# Altium schematic sheet Mynd_Conn.SchDoc: =SCH_Title
size A3; DocumentNumber: 1; SheetNumber: 1; SheetTotal: 1
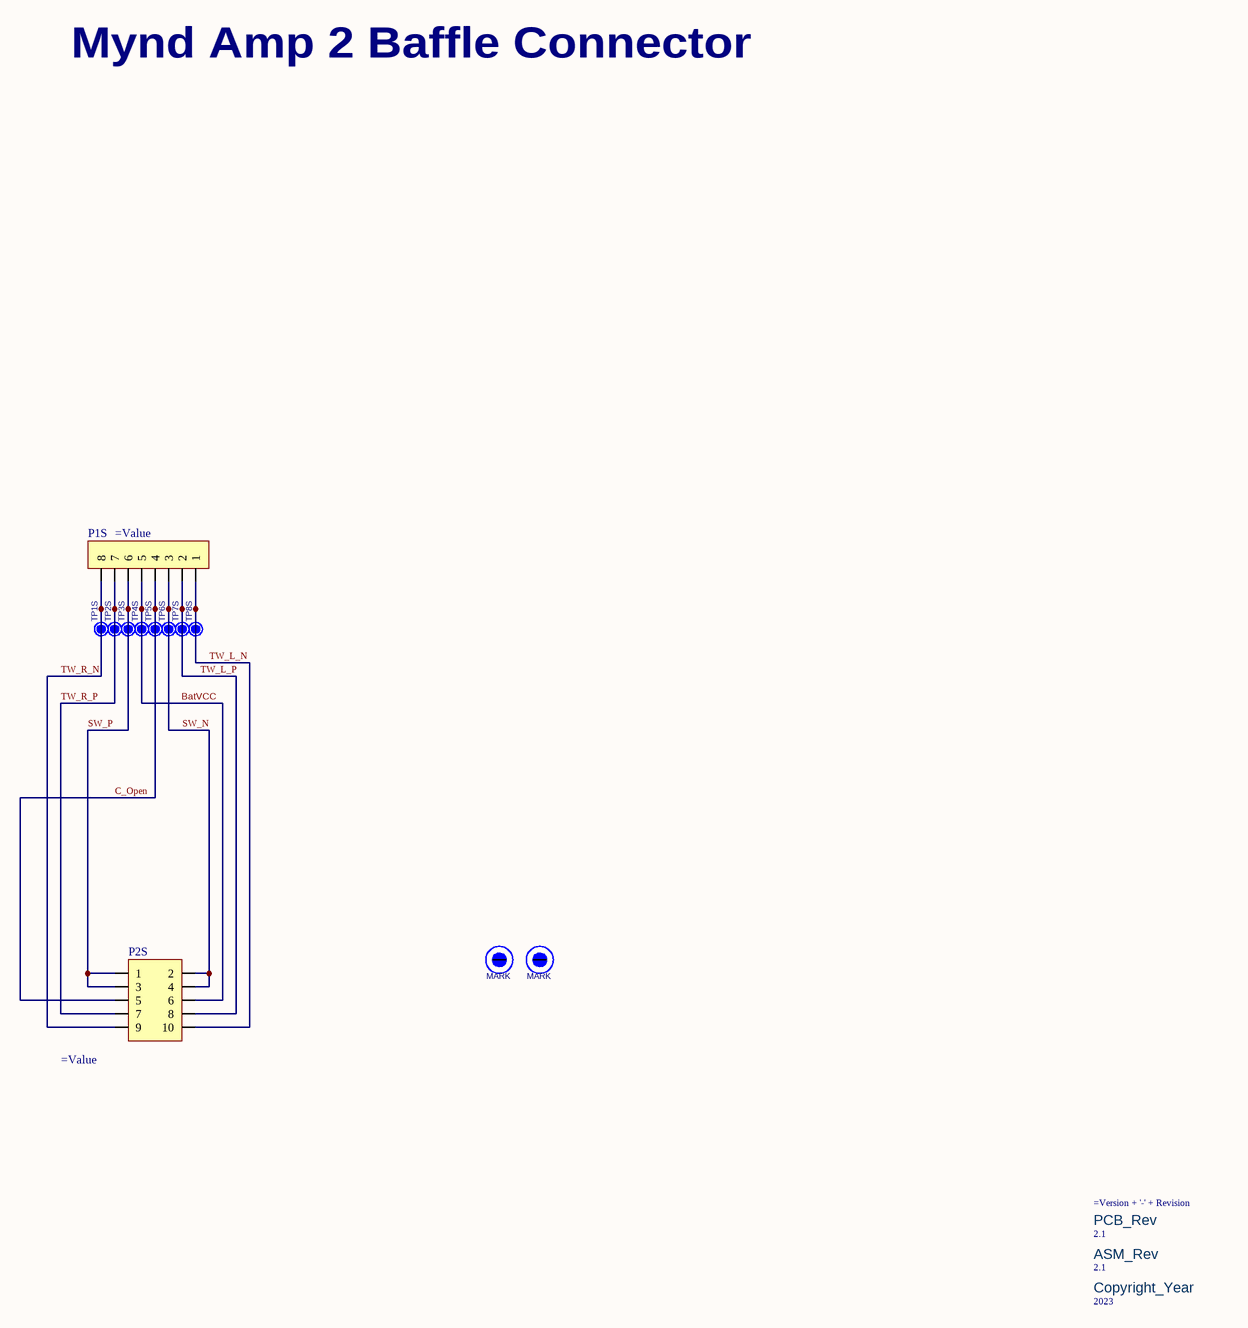
[diagram p0: Mynd_Conn.SchDoc]

## Parts
MK1S  MARK  [MARK]  (no BOM)
MK2S  MARK  [MARK]  (no BOM)
P1S  (no value)  [CJL008DH250197]
P2S  (no value)  [Pin_Header_SMD_Side_2X5_254]
Teufel_ASM_Label1S  2.1  [Teufel_ASM_Rev]  (no BOM)
Teufel_Copyright1S  2023  [Teufel_Copyright]  (no BOM)
Teufel_PCB_Label1S  2.1  [Teufel_PCB_Rev]  (no BOM)
Teufel_PCB_Logo?  (no value)  [Teufel_NoLogo]  (no BOM)
TP1S  TP12  [TP120]  (value not drawn)  (no BOM)
TP2S  TP12  [TP120]  (value not drawn)  (no BOM)
TP3S  TP12  [TP120]  (value not drawn)  (no BOM)
TP4S  TP12  [TP120]  (value not drawn)  (no BOM)
TP5S  TP12  [TP120]  (value not drawn)  (no BOM)
TP6S  TP12  [TP120]  (value not drawn)  (no BOM)
TP7S  TP12  [TP120]  (value not drawn)  (no BOM)
TP8S  TP12  [TP120]  (value not drawn)  (no BOM)

## Nets
BatVCC: P1S.5 P2S.6 TP4S.1
C_Open: P1S.4 P2S.5 TP5S.1
SW_N: P1S.3 P2S.2 P2S.4 TP6S.1
SW_P: P1S.6 P2S.1 P2S.3 TP3S.1
TW_L_N: P1S.1 P2S.10 TP8S.1
TW_L_P: P1S.2 P2S.8 TP7S.1
TW_R_N: P1S.8 P2S.9 TP1S.1
TW_R_P: P1S.7 P2S.7 TP2S.1

Not connected (* = marked no-connect by the designer): MK1S MK_B MK_T; MK2S MK_B MK_T

## Notes on the sheet
- Mynd Amp 2 Baffle Connector
- Revision:
- Lautspreecher Teufel GmbH
- Budapester Straße 44
- 10787 Berlin
- Germany
- Page Title:
- Engineer:
- Project:
- Version:
- Rev:
- modified:
- Date:
- Size:
- A3
- File Name:
- Page:
- of
- (in symbol Teufel_ASM_Rev) ASM_Rev
- (in symbol Teufel_Copyright) Copyright_Year
- (in symbol Teufel_PCB_Rev) PCB_Rev

## Library data of the parts
MK1S MK2S = N-001-00003-2: MARK DOT; Design Item ID: MARK
P1S = C-001-1104-3: SMD BTB CONNECTOR 8P P2.5mm GOLD; Manufacturer: CHUANGJIEL; Part_Type: Connector BTB SMT; Value: CJL008DH250197; System: Connector; Part_Number: CJL008DH250197
P2S = C-001-1092-3: SMD BTB CONNECTOR 10P P2.54mm GOLD; Manufacturer: MINGHENG; Part_Number: 2.54PH H2.5 2x5Pin; Part_Type: Connector BTB SMT; Value: 2.54PH H2.5 2x5Pin; System: Connector
Teufel_ASM_Label1S = Teufel_ASM_Rev: Teufel Assembly Rev. PCB Label; Value: 2.1
Teufel_Copyright1S = Teufel_Copyright: Teufel Copyright PCB Label; Value: 2023
Teufel_PCB_Label1S = Teufel_PCB_Rev: Teufel PCB Rev. PCB Label; Value: 2.1
Teufel_PCB_Logo? = Teufel NoLogo: Teufel PCB NoLogo
TP1S TP2S TP3S TP4S TP5S TP6S TP7S TP8S = N-001-00010-2: Test Point; Design Item ID: TP